# EAGLE schematic LED_sculpture (EAGLE 9.4.2)
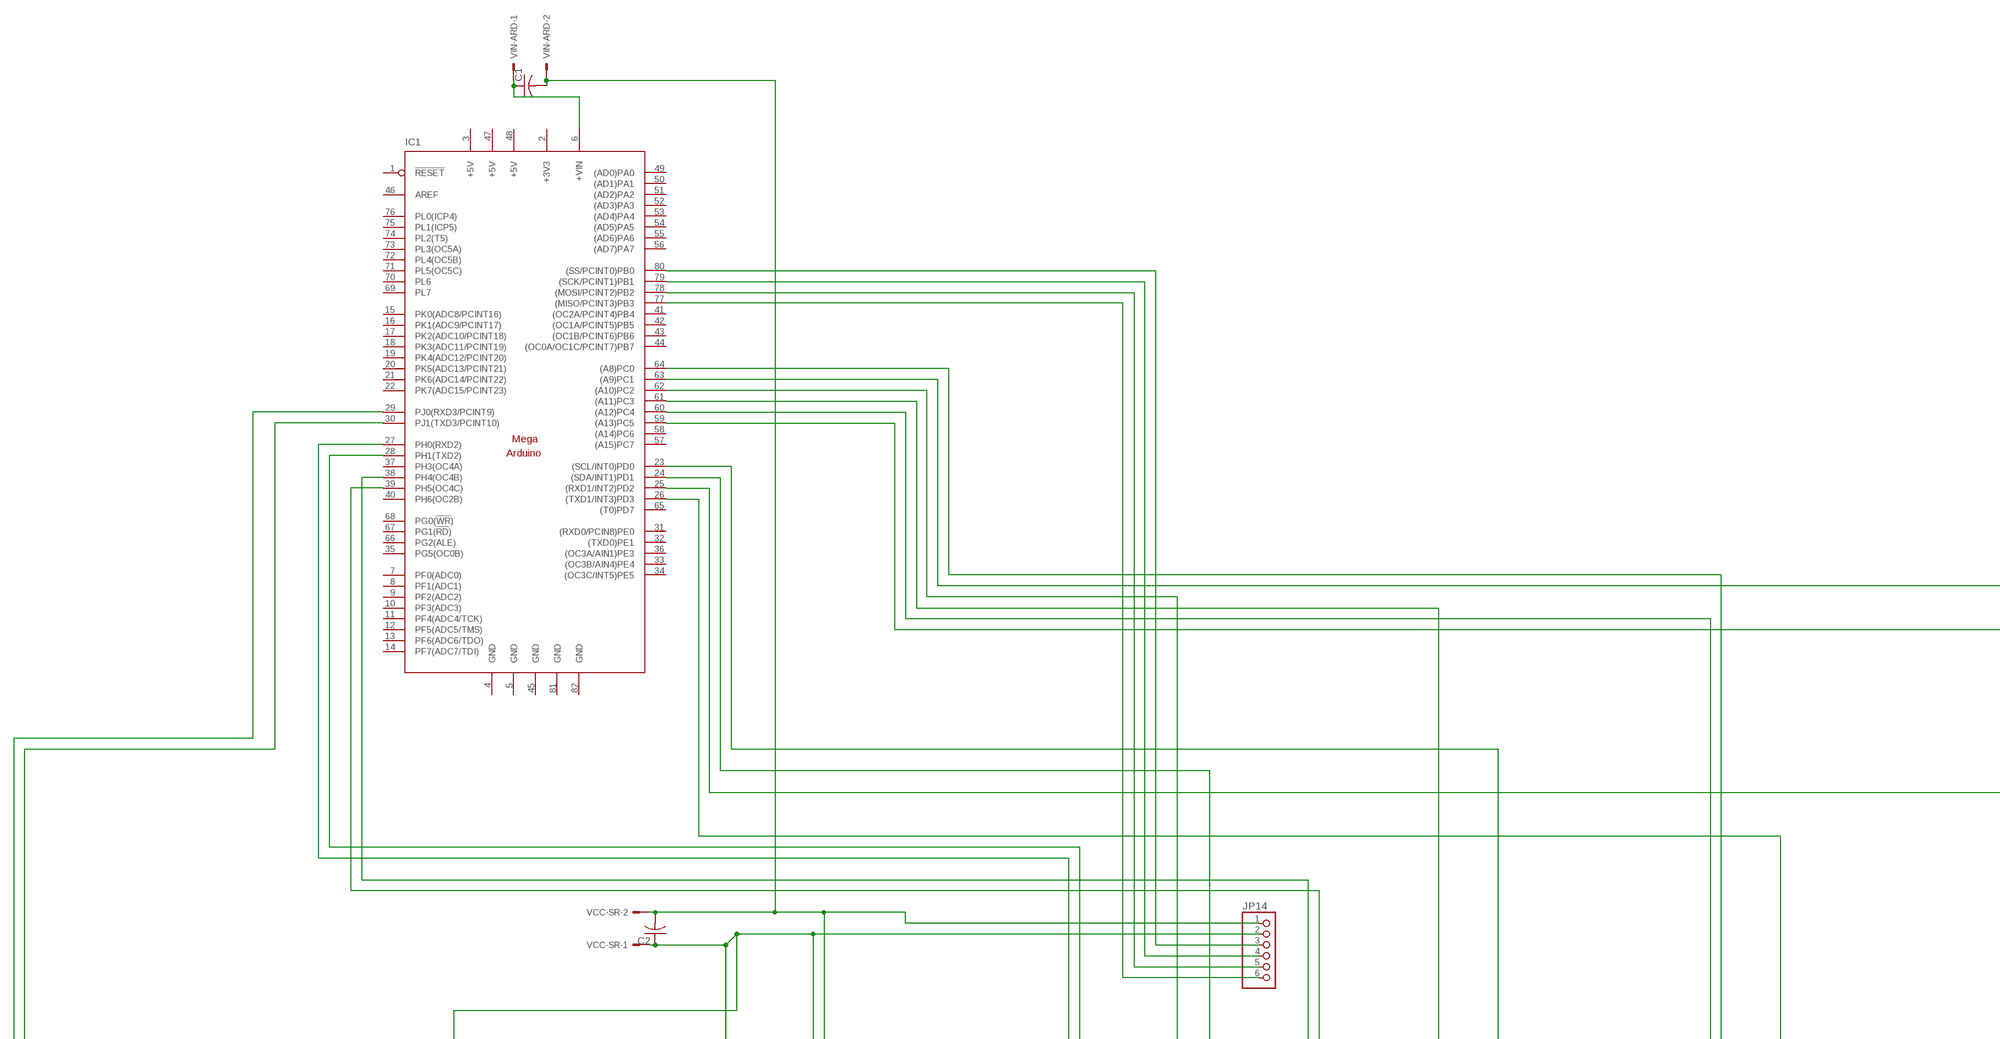
[diagram p0: schematic, sheet 1, part 1 of 3]
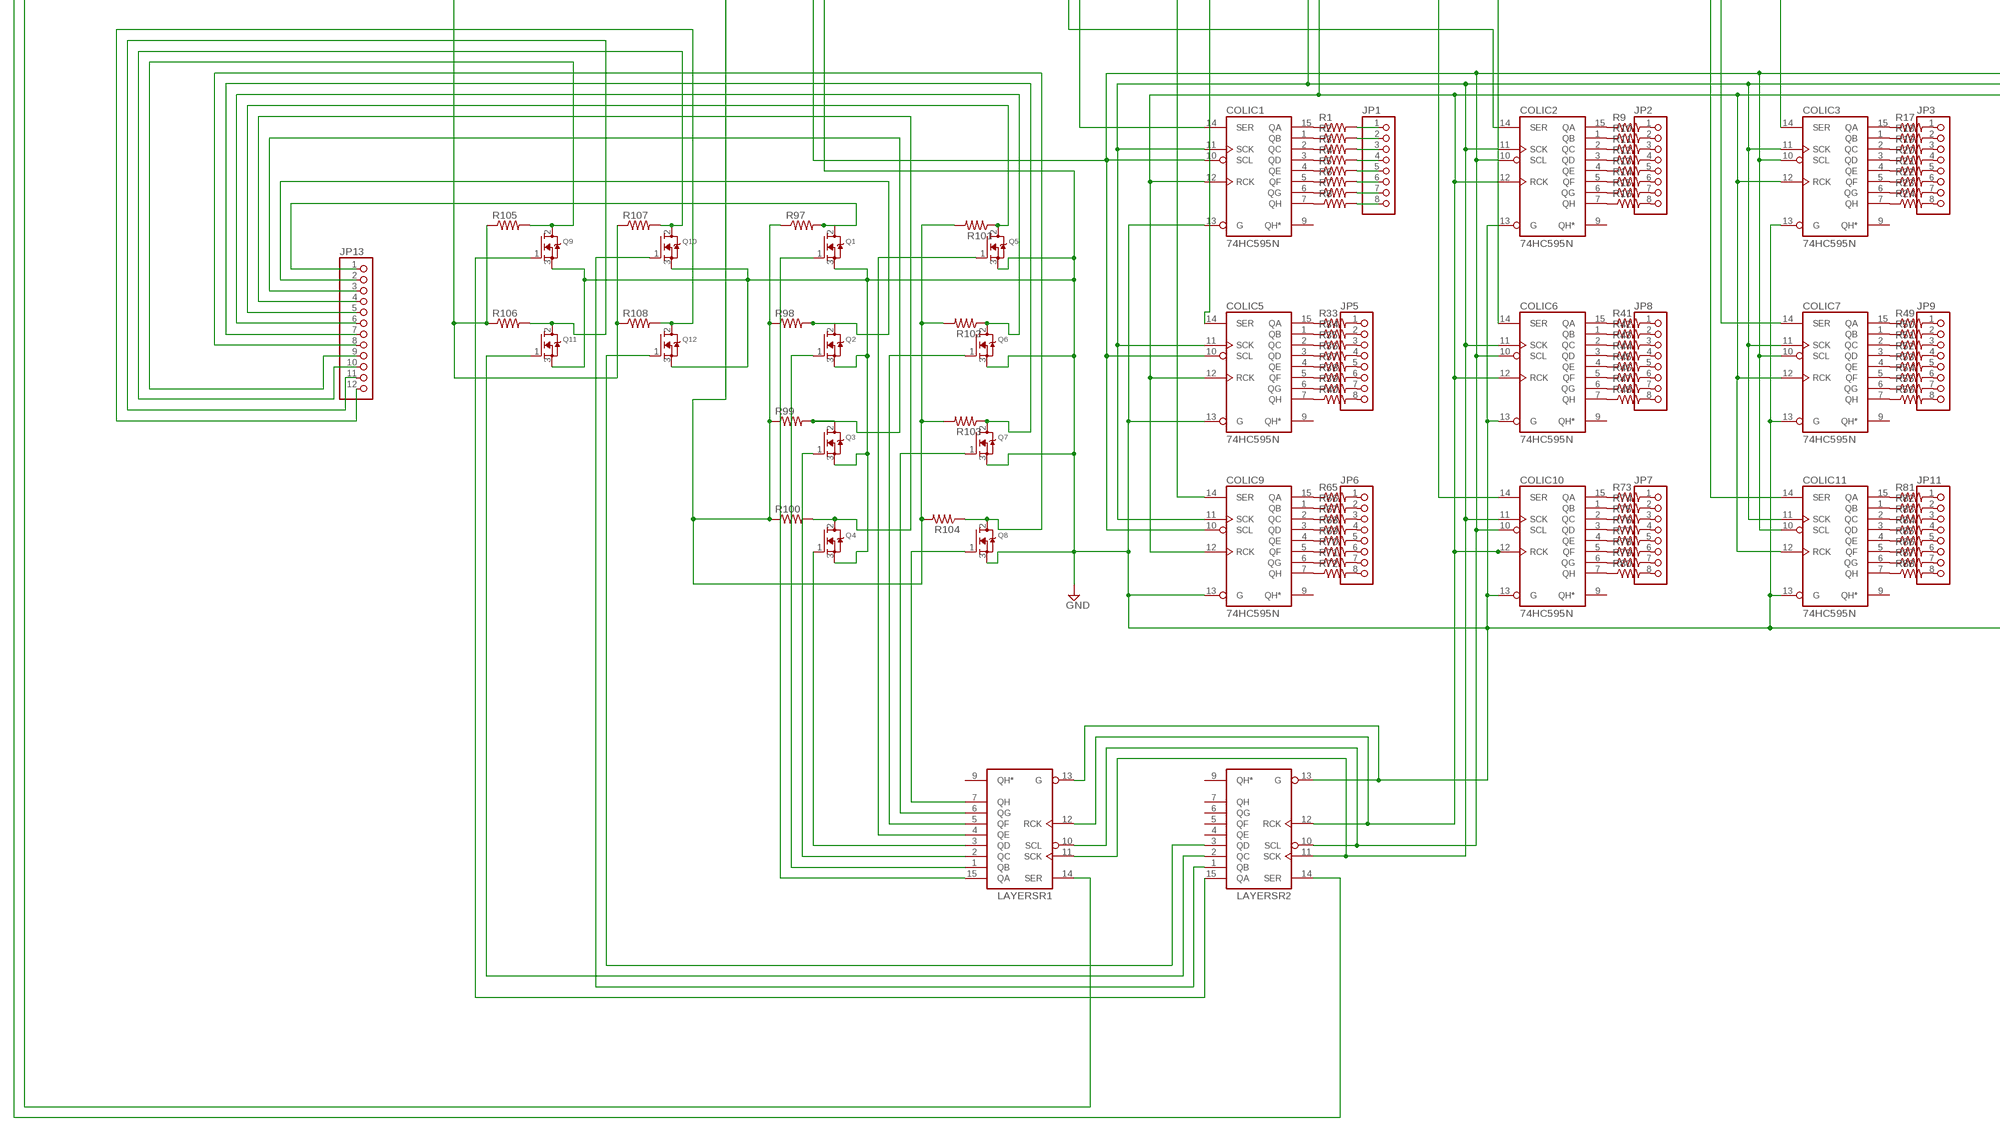
[diagram p1: schematic, sheet 1, part 2 of 3]
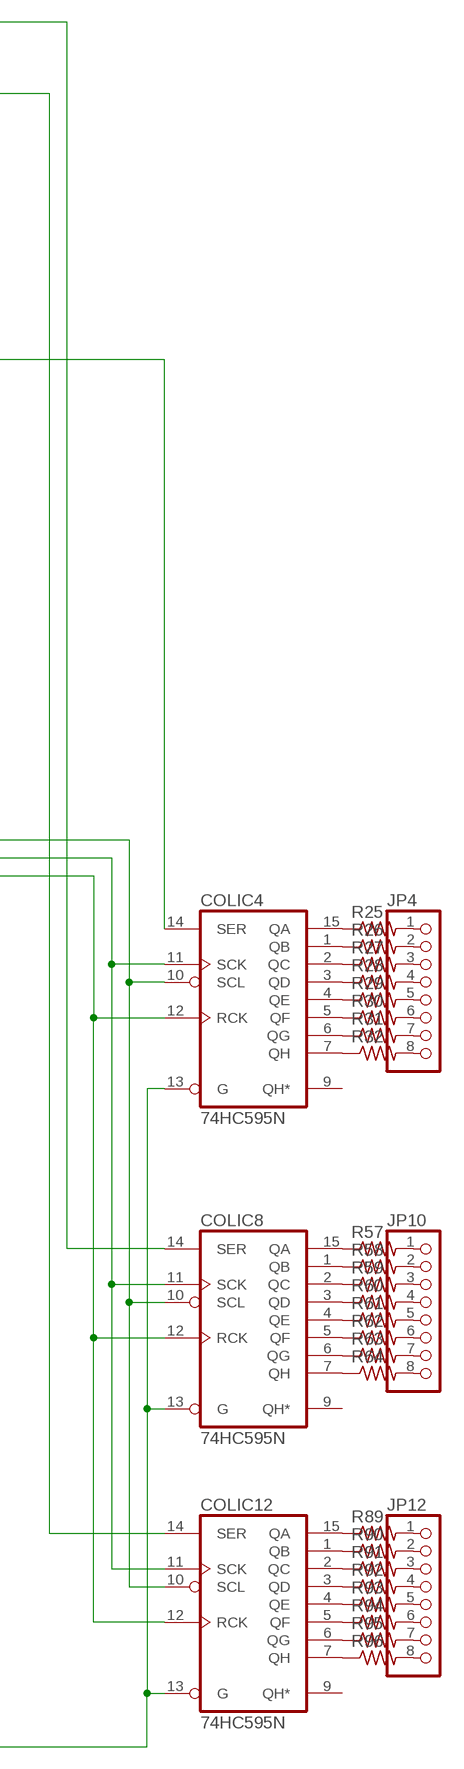
[diagram p2: schematic, sheet 1, part 3 of 3]

## Parts
C1  C-US025-025X050  [C025-025X050]
C2  C-US025-025X050  [C025-025X050]
COLIC1  74HC595N  [DIL16]
COLIC2  74HC595N  [DIL16]
COLIC3  74HC595N  [DIL16]
COLIC4  74HC595N  [DIL16]
COLIC5  74HC595N  [DIL16]
COLIC6  74HC595N  [DIL16]
COLIC7  74HC595N  [DIL16]
COLIC8  74HC595N  [DIL16]
COLIC9  74HC595N  [DIL16]
COLIC10  74HC595N  [DIL16]
COLIC11  74HC595N  [DIL16]
COLIC12  74HC595N  [DIL16]
IC1  MEGAARDUINO_1  [MEGA_ARDUINO]
JP1  PINHD-1X8CLEANBIG  [1X08-CLEANBIG]
JP2  PINHD-1X8CLEANBIG  [1X08-CLEANBIG]
JP3  PINHD-1X8CLEANBIG  [1X08-CLEANBIG]
JP4  PINHD-1X8CLEANBIG  [1X08-CLEANBIG]
JP5  PINHD-1X8CLEANBIG  [1X08-CLEANBIG]
JP6  PINHD-1X8CLEANBIG  [1X08-CLEANBIG]
JP7  PINHD-1X8CLEANBIG  [1X08-CLEANBIG]
JP8  PINHD-1X8CLEANBIG  [1X08-CLEANBIG]
JP9  PINHD-1X8CLEANBIG  [1X08-CLEANBIG]
JP10  PINHD-1X8CLEANBIG  [1X08-CLEANBIG]
JP11  PINHD-1X8CLEANBIG  [1X08-CLEANBIG]
JP12  PINHD-1X8CLEANBIG  [1X08-CLEANBIG]
JP13  PINHD-1X12  [1X12]
JP14  PINHD-1X6  [1X06]
LAYERSR1  74HC595N  [DIL16]
LAYERSR2  74HC595N  [DIL16]
Q1  MOSFET-NGDS_TO220V  [TO220V]
Q2  MOSFET-NGDS_TO220V  [TO220V]
Q3  MOSFET-NGDS_TO220V  [TO220V]
Q4  MOSFET-NGDS_TO220V  [TO220V]
Q5  MOSFET-NGDS_TO220V  [TO220V]
Q6  MOSFET-NGDS_TO220V  [TO220V]
Q7  MOSFET-NGDS_TO220V  [TO220V]
Q8  MOSFET-NGDS_TO220V  [TO220V]
Q9  MOSFET-NGDS_TO220V  [TO220V]
Q10  MOSFET-NGDS_TO220V  [TO220V]
Q11  MOSFET-NGDS_TO220V  [TO220V]
Q12  MOSFET-NGDS_TO220V  [TO220V]
R1  R-US_0204/7  [0204/7]
R2  R-US_0204/7  [0204/7]
R3  R-US_0204/7  [0204/7]
R4  R-US_0204/7  [0204/7]
R5  R-US_0204/7  [0204/7]
R6  R-US_0204/7  [0204/7]
R7  R-US_0204/7  [0204/7]
R8  R-US_0204/7  [0204/7]
R9  R-US_0204/7  [0204/7]
R10  R-US_0204/7  [0204/7]
R11  R-US_0204/7  [0204/7]
R12  R-US_0204/7  [0204/7]
R13  R-US_0204/7  [0204/7]
R14  R-US_0204/7  [0204/7]
R15  R-US_0204/7  [0204/7]
R16  R-US_0204/7  [0204/7]
R17  R-US_0204/7  [0204/7]
R18  R-US_0204/7  [0204/7]
R19  R-US_0204/7  [0204/7]
R20  R-US_0204/7  [0204/7]
R21  R-US_0204/7  [0204/7]
R22  R-US_0204/7  [0204/7]
R23  R-US_0204/7  [0204/7]
R24  R-US_0204/7  [0204/7]
R25  R-US_0204/7  [0204/7]
R26  R-US_0204/7  [0204/7]
R27  R-US_0204/7  [0204/7]
R28  R-US_0204/7  [0204/7]
R29  R-US_0204/7  [0204/7]
R30  R-US_0204/7  [0204/7]
R31  R-US_0204/7  [0204/7]
R32  R-US_0204/7  [0204/7]
R33  R-US_0204/7  [0204/7]
R34  R-US_0204/7  [0204/7]
R35  R-US_0204/7  [0204/7]
R36  R-US_0204/7  [0204/7]
R37  R-US_0204/7  [0204/7]
R38  R-US_0204/7  [0204/7]
R39  R-US_0204/7  [0204/7]
R40  R-US_0204/7  [0204/7]
R41  R-US_0204/7  [0204/7]
R42  R-US_0204/7  [0204/7]
R43  R-US_0204/7  [0204/7]
R44  R-US_0204/7  [0204/7]
R45  R-US_0204/7  [0204/7]
R46  R-US_0204/7  [0204/7]
R47  R-US_0204/7  [0204/7]
R48  R-US_0204/7  [0204/7]
R49  R-US_0204/7  [0204/7]
R50  R-US_0204/7  [0204/7]
R51  R-US_0204/7  [0204/7]
R52  R-US_0204/7  [0204/7]
R53  R-US_0204/7  [0204/7]
R54  R-US_0204/7  [0204/7]
R55  R-US_0204/7  [0204/7]
R56  R-US_0204/7  [0204/7]
R57  R-US_0204/7  [0204/7]
R58  R-US_0204/7  [0204/7]
R59  R-US_0204/7  [0204/7]
R60  R-US_0204/7  [0204/7]
R61  R-US_0204/7  [0204/7]
R62  R-US_0204/7  [0204/7]
R63  R-US_0204/7  [0204/7]
R64  R-US_0204/7  [0204/7]
R65  R-US_0204/7  [0204/7]
R66  R-US_0204/7  [0204/7]
R67  R-US_0204/7  [0204/7]
R68  R-US_0204/7  [0204/7]
R69  R-US_0204/7  [0204/7]
R70  R-US_0204/7  [0204/7]
R71  R-US_0204/7  [0204/7]
R72  R-US_0204/7  [0204/7]
R73  R-US_0204/7  [0204/7]
R74  R-US_0204/7  [0204/7]
R75  R-US_0204/7  [0204/7]
R76  R-US_0204/7  [0204/7]
R77  R-US_0204/7  [0204/7]
R78  R-US_0204/7  [0204/7]
R79  R-US_0204/7  [0204/7]
R80  R-US_0204/7  [0204/7]
R81  R-US_0204/7  [0204/7]
R82  R-US_0204/7  [0204/7]
R83  R-US_0204/7  [0204/7]
R84  R-US_0204/7  [0204/7]
R85  R-US_0204/7  [0204/7]
R86  R-US_0204/7  [0204/7]
R87  R-US_0204/7  [0204/7]
R88  R-US_0204/7  [0204/7]
R89  R-US_0204/7  [0204/7]
R90  R-US_0204/7  [0204/7]
R91  R-US_0204/7  [0204/7]
R92  R-US_0204/7  [0204/7]
R93  R-US_0204/7  [0204/7]
R94  R-US_0204/7  [0204/7]
R95  R-US_0204/7  [0204/7]
R96  R-US_0204/7  [0204/7]
R97  R-US_0204/7  [0204/7]
R98  R-US_0204/7  [0204/7]
R99  R-US_0204/7  [0204/7]
R100  R-US_0204/7  [0204/7]
R101  R-US_0204/7  [0204/7]
R102  R-US_0204/7  [0204/7]
R103  R-US_0204/7  [0204/7]
R104  R-US_0204/7  [0204/7]
R105  R-US_0204/7  [0204/7]
R106  R-US_0204/7  [0204/7]
R107  R-US_0204/7  [0204/7]
R108  R-US_0204/7  [0204/7]
VCC-SR  KK-156-2  [KK-156-2]
VIN-ARD  KK-156-2  [KK-156-2]

## Nets
5V: C2.1 COLIC1.10(SCL) COLIC2.10(SCL) COLIC3.10(SCL) COLIC4.10(SCL) COLIC5.10(SCL) COLIC6.10(SCL) COLIC7.10(SCL) COLIC8.10(SCL) COLIC9.10(SCL) COLIC10.10(SCL) COLIC11.10(SCL) COLIC12.10(SCL) JP14.2 LAYERSR1.10(SCL) LAYERSR2.10(SCL) R97.1 R98.1 R99.1 R100.1 R101.2 R102.2 R103.2 R104.2 R105.1 R106.1 R107.1 R108.1 VCC-SR.1
GND: C1.2 C2.2 COLIC1.13(G) COLIC2.13(G) COLIC3.13(G) COLIC4.13(G) COLIC5.13(G) COLIC6.13(G) COLIC7.13(G) COLIC8.13(G) COLIC9.13(G) COLIC10.13(G) COLIC11.13(G) COLIC12.13(G) JP14.1 LAYERSR1.13(G) LAYERSR2.13(G) Q1.3(S) Q2.3(S) Q3.3(S) Q4.3(S) Q5.3(S) Q6.3(S) Q7.3(S) Q8.3(S) Q9.3(S) Q10.3(S) Q11.3(S) Q12.3(S) VCC-SR.2 VIN-ARD.2
N$1: LAYERSR1.7(QH) Q8.1(G)
N$2: LAYERSR1.6(QG) Q7.1(G)
N$3: LAYERSR1.5(QF) Q6.1(G)
N$4: LAYERSR1.4(QE) Q5.1(G)
N$5: LAYERSR1.3(QD) Q4.1(G)
N$6: LAYERSR1.2(QC) Q3.1(G)
N$7: JP13.1 Q1.2(D) R97.2
N$8: LAYERSR1.15(QA) Q1.1(G)
N$9: LAYERSR2.3(QD) Q12.1(G)
N$10: JP13.5 Q5.2(D) R101.1
N$11: JP13.3 Q3.2(D) R99.2
N$12: JP13.6 Q6.2(D) R102.1
N$13: IC1.78((MOSI/PCINT2)PB2) JP14.5
N$14: JP13.2 Q2.2(D) R98.2
N$15: IC1.77((MISO/PCINT3)PB3) JP14.6
N$16: JP13.4 Q4.2(D) R100.2
N$17: IC1.79((SCK/PCINT1)PB1) JP14.4
N$18: LAYERSR2.2(QC) Q11.1(G)
N$19: IC1.80((SS/PCINT0)PB0) JP14.3
N$20: LAYERSR2.15(QA) Q9.1(G)
N$21: COLIC7.14(SER) IC1.64((A8)PC0)
N$22: JP13.7 Q7.2(D) R103.1
N$23: COLIC9.14(SER) IC1.62((A10)PC2)
N$24: JP13.8 Q8.2(D) R104.1
N$25: JP13.9 Q9.2(D) R105.2
N$26: JP13.10 Q10.2(D) R107.2
N$27: JP13.11 Q11.2(D) R106.2
N$28: JP13.12 Q12.2(D) R108.2
N$29: COLIC8.14(SER) IC1.63((A9)PC1)
N$32: IC1.30(PJ1(TXD3/PCINT10)) LAYERSR1.14(SER)
N$33: COLIC2.15(QA) R9.1
N$34: COLIC1.15(QA) R1.1
N$35: COLIC1.1(QB) R2.1
N$36: COLIC1.2(QC) R3.1
N$37: COLIC1.3(QD) R4.1
N$38: COLIC1.4(QE) R5.1
N$39: COLIC1.5(QF) R6.1
N$40: COLIC1.6(QG) R7.1
N$41: COLIC1.7(QH) R8.1
N$42: COLIC2.1(QB) R10.1
N$43: COLIC2.2(QC) R11.1
N$44: COLIC2.3(QD) R12.1
N$45: COLIC2.4(QE) R13.1
N$46: COLIC2.5(QF) R14.1
N$47: COLIC2.6(QG) R15.1
N$48: COLIC2.7(QH) R16.1
N$49: COLIC3.15(QA) R17.1
N$50: COLIC3.1(QB) R18.1
N$51: COLIC3.2(QC) R19.1
N$52: COLIC3.3(QD) R20.1
N$53: COLIC3.4(QE) R21.1
N$54: COLIC3.5(QF) R22.1
N$55: COLIC3.6(QG) R23.1
N$56: COLIC3.7(QH) R24.1
N$57: COLIC4.15(QA) R25.1
N$58: COLIC4.1(QB) R26.1
N$59: COLIC4.2(QC) R27.1
N$60: COLIC4.3(QD) R28.1
N$61: COLIC4.4(QE) R29.1
N$62: COLIC4.5(QF) R30.1
N$63: COLIC4.6(QG) R31.1
N$64: COLIC4.7(QH) R32.1
N$65: COLIC5.15(QA) R33.1
N$66: COLIC5.1(QB) R34.1
N$67: COLIC5.2(QC) R35.1
N$68: COLIC5.3(QD) R36.1
N$69: COLIC5.4(QE) R37.1
N$70: COLIC5.5(QF) R38.1
N$71: COLIC5.6(QG) R39.1
N$72: COLIC5.7(QH) R40.1
N$73: COLIC6.15(QA) R41.1
N$74: COLIC6.1(QB) R42.1
N$75: COLIC6.2(QC) R43.1
N$76: COLIC6.3(QD) R44.1
N$77: COLIC6.4(QE) R45.1
N$78: COLIC6.5(QF) R46.1
N$79: COLIC6.6(QG) R47.1
N$80: COLIC6.7(QH) R48.1
N$81: COLIC7.15(QA) R49.1
N$82: COLIC7.1(QB) R50.1
N$83: COLIC7.2(QC) R51.1
N$84: COLIC7.3(QD) R52.1
N$85: COLIC7.4(QE) R53.1
N$86: COLIC7.5(QF) R54.1
N$87: COLIC7.6(QG) R55.1
N$88: COLIC7.7(QH) R56.1
N$89: COLIC8.15(QA) R57.1
N$90: COLIC8.1(QB) R58.1
N$91: COLIC8.2(QC) R59.1
N$92: COLIC8.3(QD) R60.1
N$93: COLIC8.4(QE) R61.1
N$94: COLIC8.5(QF) R62.1
N$95: COLIC8.6(QG) R63.1
N$96: COLIC8.7(QH) R64.1
N$97: COLIC9.15(QA) R65.1
N$98: COLIC9.1(QB) R66.1
N$99: COLIC9.2(QC) R67.1
N$100: COLIC9.3(QD) R68.1
N$101: COLIC9.4(QE) R69.1
N$102: COLIC9.5(QF) R70.1
N$103: COLIC9.6(QG) R71.1
N$104: COLIC9.7(QH) R72.1
N$105: COLIC10.15(QA) R73.1
N$106: COLIC10.1(QB) R74.1
N$107: COLIC10.2(QC) R75.1
N$108: COLIC10.3(QD) R76.1
N$109: COLIC10.4(QE) R77.1
N$110: COLIC10.5(QF) R78.1
N$111: COLIC10.6(QG) R79.1
N$112: COLIC10.7(QH) R80.1
N$113: COLIC11.15(QA) R81.1
N$114: COLIC11.1(QB) R82.1
N$115: COLIC11.2(QC) R83.1
N$116: COLIC11.3(QD) R84.1
N$117: COLIC11.4(QE) R85.1
N$118: COLIC11.5(QF) R86.1
N$119: COLIC11.6(QG) R87.1
N$120: COLIC11.7(QH) R88.1
N$121: COLIC12.15(QA) R89.1
N$122: COLIC12.1(QB) R90.1
N$123: COLIC12.2(QC) R91.1
N$124: COLIC12.3(QD) R92.1
N$125: COLIC12.4(QE) R93.1
N$126: COLIC12.5(QF) R94.1
N$127: COLIC12.6(QG) R95.1
N$128: COLIC12.7(QH) R96.1
N$129: JP1.1 R1.2
N$130: JP1.2 R2.2
N$131: JP1.3 R3.2
N$132: JP1.4 R4.2
N$133: JP1.5 R5.2
N$134: JP1.6 R6.2
N$135: JP1.7 R7.2
N$136: JP1.8 R8.2
N$137: JP2.1 R9.2
N$138: JP2.2 R10.2
N$139: JP2.3 R11.2
N$140: JP2.4 R12.2
N$141: JP2.5 R13.2
N$142: JP2.6 R14.2
N$143: JP2.7 R15.2
N$144: JP2.8 R16.2
N$145: JP3.1 R17.2
N$146: JP3.2 R18.2
N$147: JP3.3 R19.2
N$148: JP3.4 R20.2
N$149: JP3.5 R21.2
N$150: JP3.6 R22.2
N$151: JP3.7 R23.2
N$152: JP3.8 R24.2
N$153: JP4.1 R25.2
N$154: JP4.2 R26.2
N$155: JP4.3 R27.2
N$156: JP4.4 R28.2
N$157: JP4.5 R29.2
N$158: JP4.6 R30.2
N$159: JP4.7 R31.2
N$160: JP4.8 R32.2
N$161: JP5.1 R33.2
N$162: JP5.2 R34.2
N$163: JP5.3 R35.2
N$164: JP5.4 R36.2
N$165: JP5.5 R37.2
N$166: JP5.6 R38.2
N$167: JP5.7 R39.2
N$168: JP5.8 R40.2
N$169: JP6.1 R65.2
N$170: JP6.2 R66.2
N$171: JP6.3 R67.2
N$172: JP6.4 R68.2
N$173: JP6.5 R69.2
N$174: JP6.6 R70.2
N$175: JP6.7 R71.2
N$176: JP6.8 R72.2
N$177: JP7.1 R73.2
N$178: JP7.2 R74.2
N$179: JP7.3 R75.2
N$180: JP7.4 R76.2
N$181: JP7.5 R77.2
N$182: JP7.6 R78.2
N$183: JP7.7 R79.2
N$184: JP7.8 R80.2
N$185: JP8.1 R41.2
N$186: JP8.2 R42.2
N$187: JP8.3 R43.2
N$188: JP8.4 R44.2
N$189: JP8.5 R45.2
N$190: JP8.6 R46.2
N$191: JP8.7 R47.2
N$192: JP8.8 R48.2
N$193: JP9.1 R49.2
N$194: JP9.2 R50.2
N$195: JP9.3 R51.2
N$196: JP9.4 R52.2
N$197: JP9.5 R53.2
N$198: JP9.6 R54.2
N$199: JP9.7 R55.2
N$200: JP9.8 R56.2
N$201: JP10.1 R57.2
N$202: JP10.2 R58.2
N$203: JP10.3 R59.2
N$204: JP10.4 R60.2
N$205: JP10.5 R61.2
N$206: JP10.6 R62.2
N$207: JP10.7 R63.2
N$208: JP10.8 R64.2
N$209: JP11.1 R81.2
N$210: JP11.2 R82.2
N$211: JP11.3 R83.2
N$212: JP11.4 R84.2
N$213: JP11.5 R85.2
N$214: JP11.6 R86.2
N$215: JP11.7 R87.2
N$216: JP11.8 R88.2
N$217: JP12.1 R89.2
N$218: JP12.2 R90.2
N$219: JP12.3 R91.2
N$220: JP12.4 R92.2
N$221: JP12.5 R93.2
N$222: JP12.6 R94.2
N$223: JP12.7 R95.2
N$224: JP12.8 R96.2
N$225: COLIC10.14(SER) IC1.61((A11)PC3)
N$226: COLIC11.14(SER) IC1.60((A12)PC4)
N$227: COLIC12.14(SER) IC1.59((A13)PC5)
N$236: LAYERSR2.1(QB) Q10.1(G)
N$237: IC1.29(PJ0(RXD3/PCINT9)) LAYERSR2.14(SER)
N$238: COLIC1.14(SER) IC1.28(PH1(TXD2))
N$239: COLIC2.14(SER) IC1.27(PH0(RXD2))
N$240: COLIC3.14(SER) IC1.26((TXD1/INT3)PD3)
N$241: COLIC4.14(SER) IC1.25((RXD1/INT2)PD2)
N$242: COLIC1.12(RCK) COLIC2.12(RCK) COLIC3.12(RCK) COLIC4.12(RCK) COLIC5.12(RCK) COLIC6.12(RCK) COLIC7.12(RCK) COLIC8.12(RCK) COLIC9.12(RCK) COLIC10.12(RCK) COLIC11.12(RCK) COLIC12.12(RCK) IC1.39(PH5(OC4C)) LAYERSR1.12(RCK) LAYERSR2.12(RCK)
N$243: COLIC5.14(SER) IC1.24((SDA/INT1)PD1)
N$244: COLIC1.11(SCK) COLIC2.11(SCK) COLIC3.11(SCK) COLIC4.11(SCK) COLIC5.11(SCK) COLIC6.11(SCK) COLIC7.11(SCK) COLIC8.11(SCK) COLIC9.11(SCK) COLIC10.11(SCK) COLIC11.11(SCK) COLIC12.11(SCK) IC1.38(PH4(OC4B)) LAYERSR1.11(SCK) LAYERSR2.11(SCK)
N$245: COLIC6.14(SER) IC1.23((SCL/INT0)PD0)
Q3: LAYERSR1.1(QB) Q2.1(G)
VIN: C1.1 IC1.6(+VIN) VIN-ARD.1
Unconnected: COLIC1.9(QH*) COLIC2.9(QH*) COLIC3.9(QH*) COLIC4.9(QH*) COLIC5.9(QH*) COLIC6.9(QH*) COLIC7.9(QH*) COLIC8.9(QH*) COLIC9.9(QH*) COLIC10.9(QH*) COLIC11.9(QH*) COLIC12.9(QH*) IC1.1(!RESET) IC1.7(PF0(ADC0)) IC1.8(PF1(ADC1)) IC1.9(PF2(ADC2)) IC1.10(PF3(ADC3)) IC1.11(PF4(ADC4/TCK)) IC1.12(PF5(ADC5/TMS)) IC1.13(PF6(ADC6/TDO)) IC1.14(PF7(ADC7/TDI)) IC1.15(PK0(ADC8/PCINT16)) IC1.16(PK1(ADC9/PCINT17)) IC1.17(PK2(ADC10/PCINT18)) IC1.18(PK3(ADC11/PCINT19)) IC1.19(PK4(ADC12/PCINT20)) IC1.20(PK5(ADC13/PCINT21)) IC1.21(PK6(ADC14/PCINT22)) IC1.22(PK7(ADC15/PCINT23)) IC1.31((RXD0/PCIN8)PE0) IC1.32((TXD0)PE1) IC1.33((OC3B/AIN4)PE4) IC1.34((OC3C/INT5)PE5) IC1.35(PG5(OC0B)) IC1.36((OC3A/AIN1)PE3) IC1.37(PH3(OC4A)) IC1.40(PH6(OC2B)) IC1.41((OC2A/PCINT4)PB4) IC1.42((OC1A/PCINT5)PB5) IC1.43((OC1B/PCINT6)PB6) IC1.44((OC0A/OC1C/PCINT7)PB7) IC1.46(AREF) IC1.49((AD0)PA0) IC1.50((AD1)PA1) IC1.51((AD2)PA2) IC1.52((AD3)PA3) IC1.53((AD4)PA4) IC1.54((AD5)PA5) IC1.55((AD6)PA6) IC1.56((AD7)PA7) IC1.57((A15)PC7) IC1.58((A14)PC6) IC1.65((T0)PD7) IC1.66(PG2(ALE)) IC1.67(PG1(!RD!)) IC1.68(PG0(!WR!)) IC1.69(PL7) IC1.70(PL6) IC1.71(PL5(OC5C)) IC1.72(PL4(OC5B)) IC1.73(PL3(OC5A)) IC1.74(PL2(T5)) IC1.75(PL1(ICP5)) IC1.76(PL0(ICP4)) LAYERSR1.9(QH*) LAYERSR2.4(QE) LAYERSR2.5(QF) LAYERSR2.6(QG) LAYERSR2.7(QH) LAYERSR2.9(QH*)

## Power pins joined to a net without a drawn wire
+3V3: IC1.2(+3V3)
+5V: IC1.3(+5V) IC1.47(+5V) IC1.48(+5V)
GND: COLIC1.8(GND) COLIC2.8(GND) COLIC3.8(GND) COLIC4.8(GND) COLIC5.8(GND) COLIC6.8(GND) COLIC7.8(GND) COLIC8.8(GND) COLIC9.8(GND) COLIC10.8(GND) COLIC11.8(GND) COLIC12.8(GND) IC1.4(GND) IC1.5(GND) IC1.45(GND) IC1.81(GND) IC1.82(GND) LAYERSR1.8(GND) LAYERSR2.8(GND)
VCC: COLIC1.16(VCC) COLIC2.16(VCC) COLIC3.16(VCC) COLIC4.16(VCC) COLIC5.16(VCC) COLIC6.16(VCC) COLIC7.16(VCC) COLIC8.16(VCC) COLIC9.16(VCC) COLIC10.16(VCC) COLIC11.16(VCC) COLIC12.16(VCC) LAYERSR1.16(VCC) LAYERSR2.16(VCC)

## Library data of the parts
C1 C2 = adafruit:C-US: CAPACITOR, American symbol
COLIC1-COLIC12 LAYERSR1 LAYERSR2 = 74xx-eu:74*595: 8-bit SHIFT REGISTER, output latch
IC1 = arduino:MEGAARDUINO_1: The Arduino Mega is a microcontroller board based on the ATmega1280. - 54 digital input/output pins (of which 14 can be used as PWM outputs) - 16 analog inputs - 4 UARTs (hardware serial ports) - 16 MHz crystal oscillator - USB connection - power jack - ICSP header - reset button It contains everything needed to support the microcontroller; simply connect it to a computer with a USB cable or power it with a AC-to-DC adapter or battery to get started. The Mega is compatible with most shields designed for the Arduino Duemilanove or Diecimila. http://arduino.cc/en/Main/ArduinoBoardMega
JP1-JP12 = adafruit:PINHD-1X8: PIN HEADER
JP13 = adafruit:PINHD-1X12: PIN HEADER
JP14 = adafruit:PINHD-1X6: PIN HEADER
Q1-Q12 = adafruit:MOSFET-N: N-Channel Mosfet 2N7002E - 60V 260mA SOT23 [Digikey: 2N7002ET1GOSTR-ND] - REEL BSH103 - 30V 850mA SOT23 [Digikey: 568-5013-1-ND]
R1-R108 = adafruit:R-US_: RESISTOR, American symbol
VCC-SR VIN-ARD = con-molex:KK-156-2: KK 156 HEADER Source: http://www.molex.com/pdm_docs/sd/026604100_sd.pdf; MF: MOLEX; OC_FARNELL: unknown; OC_NEWARK: unknown

## Net classes
0 default: width 1.27 mm, drill 1.27 mm, clearance 0.762 mm